# EAGLE design xmega_revC (EAGLE 6.1)
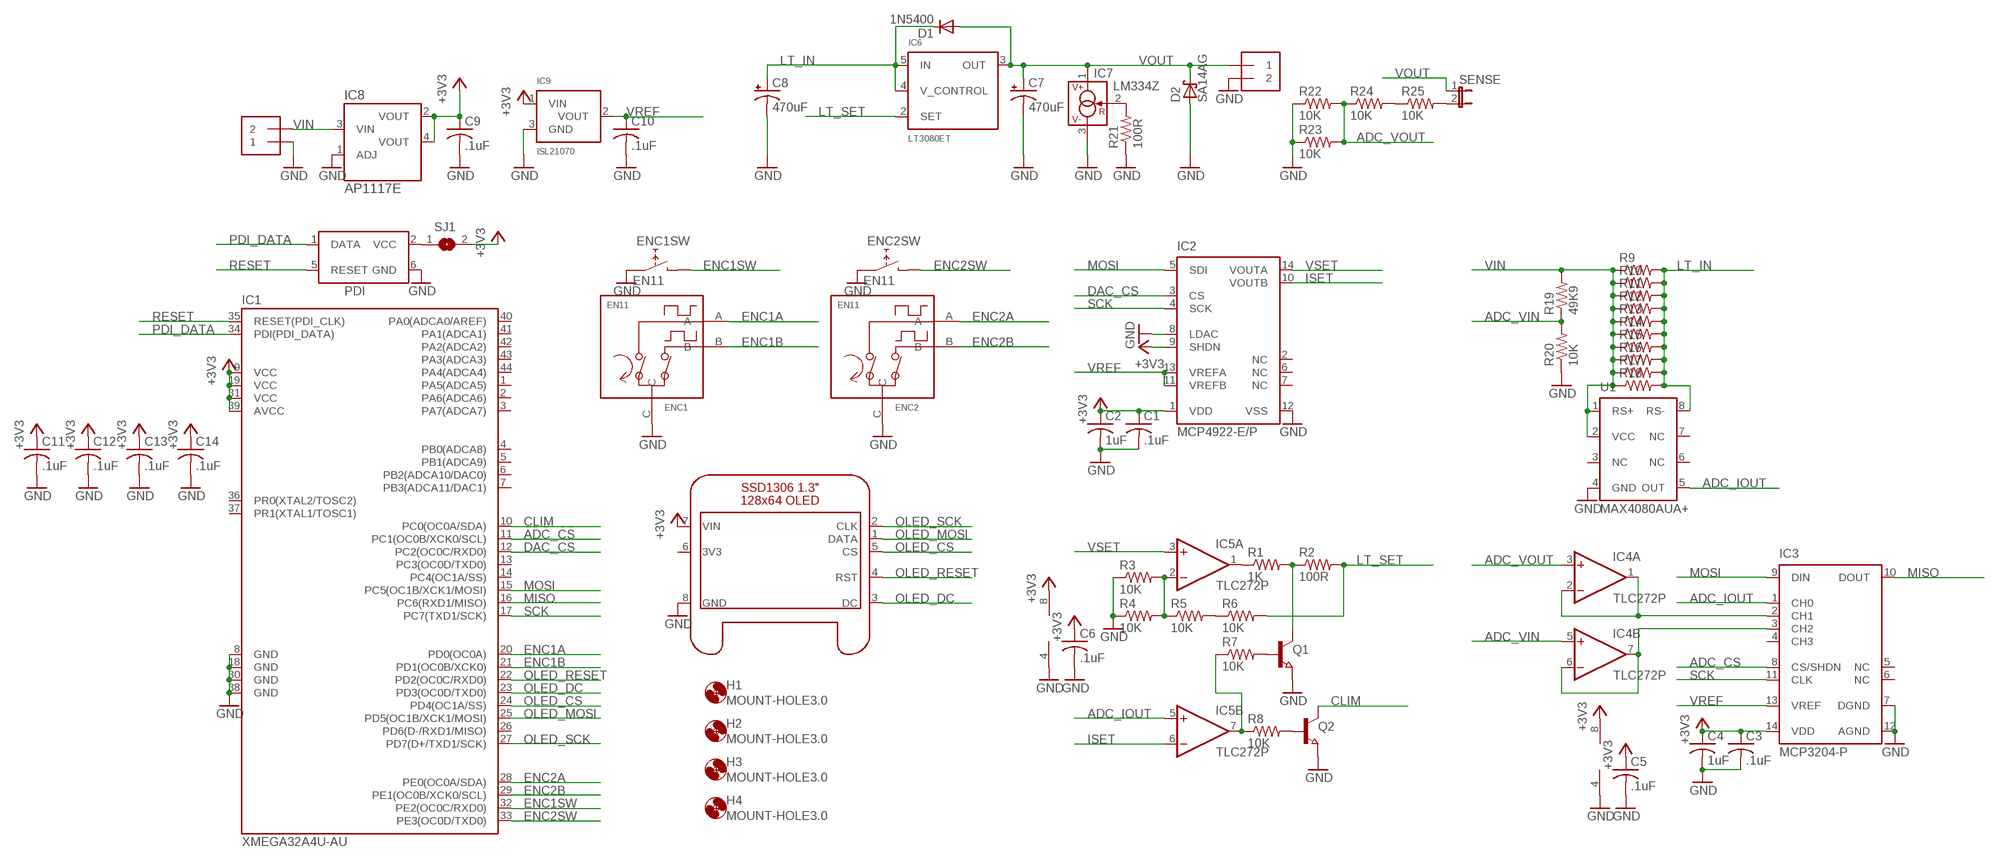
[diagram p0: schematic, sheet 1]

## Parts
C1  .1uF  C-US050-024X044  [C050-024X044]
C2  1uF  C-US050-024X044  [C050-024X044]
C3  .1uF  C-US050-024X044  [C050-024X044]
C4  1uF  C-US050-024X044  [C050-024X044]
C5  .1uF  C-US050-024X044  [C050-024X044]
C6  .1uF  C-US050-024X044  [C050-024X044]
C7  470uF  CPOL-USE5-10.5  [E5-10,5]
C8  470uF  CPOL-USE5-10.5  [E5-10,5]
C9  .1uF  C-US050-024X044  [C050-024X044]
C10  .1uF  C-US050-024X044  [C050-024X044]
C11  .1uF  C-USC0805K  [C0805K]
C12  .1uF  C-USC0805K  [C0805K]
C13  .1uF  C-USC0805K  [C0805K]
C14  .1uF  C-USC0805K  [C0805K]
D1  1N5400  [DO201-15]
D2  SA14AG  SCHOTTKY-DIODEDO41-7  [DO41-7]
ENC1  EN11  [EN11-VS*]
ENC2  EN11  [EN11-VS*]
H1  MOUNT-HOLE3.0  [3,0]
H2  MOUNT-HOLE3.0  [3,0]
H3  MOUNT-HOLE3.0  [3,0]
H4  MOUNT-HOLE3.0  [3,0]
IC1  XMEGA32A4U-AU  [TQFP44]
IC2  MCP4922-E/P  [DIL14]
IC3  MCP3204-P  [DIL14]
IC4  TLC272P  [DIL08]
IC5  TLC272P  [DIL08]
IC6  LT3080ET  [TO220-51]
IC7  LM334Z  [TO92]
IC8  AP1117E  [SOT223-3]
IC9  ISL21070  [SOT-23]
OLED1  128X64_OLED  [128X64_OLED]
OUT  1X2-3.5MM  [1X2-3.5MM]
PDI  XMEGAPDI  [AVRISP]
Q1  NPN-TRANSISTOR_SOT23  [SOT23]
Q2  NPN-TRANSISTOR_SOT23  [SOT23]
R1  1K  R-US_R0805  [R0805]
R2  100R  R-US_R0805  [R0805]
R3  10K  R-US_R0805  [R0805]
R4  10K  R-US_R0805  [R0805]
R5  10K  R-US_R0805  [R0805]
R6  10K  R-US_R0805  [R0805]
R7  10K  R-US_R0805  [R0805]
R8  10K  R-US_R0805  [R0805]
R9  R-US_0207/10  [0207/10]
R10  R-US_0207/10  [0207/10]
R11  R-US_0207/10  [0207/10]
R12  R-US_0207/10  [0207/10]
R13  R-US_0207/10  [0207/10]
R14  R-US_0207/10  [0207/10]
R15  R-US_0207/10  [0207/10]
R16  R-US_0207/10  [0207/10]
R17  R-US_0207/10  [0207/10]
R18  R-US_0207/10  [0207/10]
R19  49K9  R-US_R0805  [R0805]
R20  10K  R-US_R0805  [R0805]
R21  100R  R-US_R0805  [R0805]
R22  10K  R-US_R0805  [R0805]
R23  10K  R-US_R0805  [R0805]
R24  10K  R-US_R0805  [R0805]
R25  10K  R-US_R0805  [R0805]
SENSE  JP1E  [JP1]
SJ1  SJ  [SJ]
U1  MAX4080AUA+  [SO08]
VIN  1X2-3.5MM  [1X2-3.5MM]

## Nets
+3V3: C1.1 C2.1 C3.1 C4.1 C5.1 C6.1 C9.1 C11.1 C12.1 C13.1 C14.1 IC1.9(VCC) IC1.19(VCC) IC1.31(VCC) IC1.39(AVCC) IC2.1(VDD) IC2.9(SHDN) IC3.14(VDD) IC4.8(P:V+) IC5.8(P:V+) IC8.2(VOUT) IC8.4(VOUT) IC9.1(VIN) OLED1.7(VIN) SJ1.2
ADC_CS: IC1.11(PC1(OC0B/XCK0/SCL)) IC3.8(CS/SHDN)
ADC_IOUT: IC3.1(CH0) IC5.5(B:+IN) U1.5(OUT)
ADC_VIN: IC4.5(B:+IN) R19.1 R20.2
ADC_VOUT: IC4.3(A:+IN) R22.2 R23.2 R24.1
CLIM: IC1.10(PC0(OC0A/SDA)) Q2.3(C)
DAC_CS: IC1.12(PC2(OC0C/RXD0)) IC2.3(CS)
ENC1A: ENC1.A IC1.20(PD0(OC0A))
ENC1B: ENC1.B IC1.21(PD1(OC0B/XCK0))
ENC1SW: ENC1.E IC1.32(PE2(OC0C/RXD0))
ENC2A: ENC2.A IC1.28(PE0(OC0A/SDA))
ENC2B: ENC2.B IC1.29(PE1(OC0B/XCK0/SCL))
ENC2SW: ENC2.E IC1.33(PE3(OC0D/TXD0))
GND: C1.2 C2.2 C3.2 C4.2 C5.2 C6.2 C7.- C8.- C9.2 C10.2 C11.2 C12.2 C13.2 C14.2 D2.A ENC1.C ENC1.D ENC2.C ENC2.D IC1.8(GND) IC1.18(GND) IC1.30(GND) IC1.38(GND) IC2.8(LDAC) IC2.12(VSS) IC3.7(DGND) IC3.12(AGND) IC4.4(P:V-) IC5.4(P:V-) IC7.3(V-) IC8.1(ADJ) IC9.3(GND) OLED1.8(GND) OUT.2 PDI.6(GND) Q1.2(E) Q2.2(E) R3.1 R4.1 R20.1 R21.1 R22.1 R23.1 U1.4(GND) VIN.1
ISET: IC2.10(VOUTB) IC5.6(B:-IN)
LT_IN: C8.+ D1.C IC6.4(V_CONTROL) IC6.5(IN) R9.2 R10.2 R11.2 R12.2 R13.2 R14.2 R15.2 R16.2 R17.2 R18.2 U1.8(RS-)
LT_SET: IC6.2(SET) R2.2 R6.2
MISO: IC1.16(PC6(RXD1/MISO)) IC3.10(DOUT)
MOSI: IC1.15(PC5(OC1B/XCK1/MOSI)) IC2.5(SDI) IC3.9(DIN)
N$1: IC3.2(CH1) IC4.1(A:OUT) IC4.2(A:-IN)
N$2: IC3.3(CH2) IC4.6(B:-IN) IC4.7(B:OUT)
N$3: IC5.1(A:OUT) R1.1
N$4: Q1.3(C) R1.2 R2.1
N$5: IC5.2(A:-IN) R3.2 R4.2 R5.1
N$6: R5.2 R6.1
N$7: Q1.1(B) R7.2
N$8: IC5.7(B:OUT) R7.1 R8.1
N$9: Q2.1(B) R8.2
N$10: R25.2 SENSE.2
N$11: PDI.2(VCC) SJ1.1
N$13: IC7.2(R) R21.2
N$15: R24.2 R25.1
OLED_CS: IC1.24(PD4(OC1A/SS)) OLED1.5(CS)
OLED_DC: IC1.23(PD3(OC0D/TXD0)) OLED1.3(DC)
OLED_MOSI: IC1.25(PD5(OC1B/XCK1/MOSI)) OLED1.1(DATA)
OLED_RESET: IC1.22(PD2(OC0C/RXD0)) OLED1.4(RST)
OLED_SCK: IC1.27(PD7(D+/TXD1/SCK)) OLED1.2(CLK)
PDI_DATA: IC1.34(PDI(PDI_DATA)) PDI.1(DATA)
RESET: IC1.35(RESET(PDI_CLK)) PDI.5(RESET)
SCK: IC1.17(PC7(TXD1/SCK)) IC2.4(SCK) IC3.11(CLK)
VIN: IC8.3(VIN) R9.1 R10.1 R11.1 R12.1 R13.1 R14.1 R15.1 R16.1 R17.1 R18.1 R19.2 U1.1(RS+) U1.2(VCC) VIN.2
VOUT: C7.+ D1.A D2.C IC6.3(OUT) IC7.1(V+) OUT.1 SENSE.1
VREF: C10.1 IC2.11(VREFB) IC2.13(VREFA) IC3.13(VREF) IC9.2(VOUT)
VSET: IC2.14(VOUTA) IC5.3(A:+IN)
Unconnected: IC1.1(PA5(ADCA5)) IC1.2(PA6(ADCA6)) IC1.3(PA7(ADCA7)) IC1.4(PB0(ADCA8)) IC1.5(PB1(ADCA9)) IC1.6(PB2(ADCA10/DAC0)) IC1.7(PB3(ADCA11/DAC1)) IC1.13(PC3(OC0D/TXD0)) IC1.14(PC4(OC1A/SS)) IC1.26(PD6(D-/RXD1/MISO)) IC1.36(PR0(XTAL2/TOSC2)) IC1.37(PR1(XTAL1/TOSC1)) IC1.40(PA0(ADCA0/AREF)) IC1.41(PA1(ADCA1)) IC1.42(PA2(ADCA2)) IC1.43(PA3(ADCA3)) IC1.44(PA4(ADCA4)) IC2.2(NC) IC2.6(NC) IC2.7(NC) IC3.4(CH3) IC3.5(NC) IC3.6(NC) U1.3(NC) U1.6(NC) U1.7(NC)

## Power pins joined to a net without a drawn wire
3V3: OLED1.6(3V3)

## Library data of the parts
C1-C6 C9-C14 = adafruit:C-US: CAPACITOR, American symbol
C7 C8 = adafruit:CPOL-US: POLARIZED CAPACITOR, American symbol
D1 = diode:1N5400: DIODE standard rectifier, 3 A, 50 V (Motorola)
D2 = adafruit:SCHOTTKY-DIODE: Schottky Diode
ENC1 ENC2 = rotary-encoder:EN11
H1-H4 = holes:MOUNT-HOLE: MOUNTING HOLE with drill center marker
IC1 = atmel:XMEGA32A4U: 8/16-bit Atmel XMEGA A4U Microcontroller Features High-performance, Low-power 8/16-bit AVR XMEGA Microcontroller Non-Volatile Program and Data Memories - 16 KB - 128 KB of In-System Self-Programmable Flash - 4 KB - 8 KB Boot Code Section with Independent Lock Bits - 1 KB - 2 KB EEPROM - 2 KB - 8 KB Internal SRAM Peripheral Features - Four-channel DMA Controller with support for external requests - Eight-channel Event System - Five 16-bit Timer/Counters Three Timer/Counters with 4 Output Compare or Input Capture channels Two Timer/Counters with 2 Output Compare or Input Capture channels High-Resolution Extensions on all Timer/Counters Advanced Waveform Extension on one Timer/Counter - One USB device interface USB 2.0 full speed (12Mbps) and low speed (1.5Mbps) device compliant 32 Endpoints with full configuration flexibility - Five USARTs IrDA Extension on one USART - Two Two-Wire Interfaces with dual address match (I2C and SMBus compatible) - Two SPIs (Serial Peripheral Interfaces) peripherals - AES and DES Crypto Engine - 16-bit Real Time Counter with Separate Oscillator - One Twelve-channel, 12-bit, 2 Msps Analog to Digital Converter - One Two-channel, 12-bit, 1 Msps Digital to Analog Converter - Two Analog Comparators with Window compare function - External Interrupts on all General Purpose I/O pins - Programmable Watchdog Timer with Separate On-chip Ultra Low Power Oscillator Special Microcontroller Features - Power-on Reset and Programmable Brown-out Detection - Internal and External Clock Options with PLL - Programmable Multi-level Interrupt Controller - Sleep Modes: Idle, Power-down, Standby, Power-save, Extended Standby - Advanced Programming, Test and Debugging Interfaces PDI (Program and Debug Interface) for programming, test and debugging I/O and Packages - 34 Programmable I/O Lines - 44 - lead TQFP - 44 - pad VQFN/QFN - 49 - ball VFBGA Operating Voltage - 1.6 - 3.6V Speed performance - 0 - 12 MHz @ 1.6 - 3.6V - 0 - 32 MHz @ 2.7 - 3.6V
IC2 = microchip:MCP4922: MCP49X2 8/10/12-Bit Dual Voltage Output Digital-to-Analog Converter with SPI Interface Source: MCP4902/4912/4922 Datasheet <http://ww1.microchip.com/downloads/en/DeviceDoc/22250A.pdf/>
IC3 = microchip:MCP3204: MCP3204 2.7V 4-Channel 12-Bit A/D Converters with SPI Serial Interface Source: MCP3204/08 Datasheet <http://ww1.microchip.com/downloads/en/DeviceDoc/21298E.pdf>
IC4 IC5 = linear:TLC272: OP AMP
IC6 = linear:LT3080
IC7 = linear:LM*34: 3-Terminal Adjustable Current Sources Source: www.national.com/pf/LM/LM334.html | LM134.pdf
IC8 = Diodes Inc:AP1117: AP1117 1A Low Dropout Positive Adjustable or Fixed-Mode Regualtor Source: AP1117 Datasheet <http://www.diodes.com/datasheets/AP1117.pdf>
IC9 = intersil:ISL21070
OLED1 = oled displays:128X64_OLED: SSD1306 1.3" 128x64 OLED Display These displays are small, only about 1.3" diagonal, but very readable due to the high contrast of an OLED display. This display is made of 128x64 individual white OLED pixels, each one is turned on or off by the controller chip. Because the display makes its own light, no backlight is required. This reduces the power required to run the OLED and is why the display has such high contrast; we really like this miniature display for its crispness! The driver chip, SSD1306 can communicate in two ways: I2C or SPI. The OLED itself require a 3.3V power supply and 3.3V logic levels for communication, but we include a 3.3V regulator and all pins are fully level shifted so you can use with 5V devices! The power requirements depend a little on how much of the display is lit but on average the display uses about 40mA from the 3.3V supply. Built into the OLED driver is a simple switch-cap charge pump that turns 3.3v-5v into a high voltage drive for the OLEDs. Adafruit Product Page <http://www.adafruit.com/products/938>
OUT VIN = adafruit:1X2: 3.5mm Terminal block http://www.ladyada.net/library/pcb/eaglelibrary.html
PDI = icsp:XMEGAPDI: ATXmega PDI Header Program and Debug Interface
Q1 Q2 = semicon-smd-ipc:NPN-TRANSISTOR_: NPN TRANSISTOR
R1-R25 = adafruit:R-US_: RESISTOR, American symbol
SENSE = jumper:JP1E: JUMPER
SJ1 = jumper:SJ: SMD solder JUMPER
U1 = maxim:MAX4080: MAX4080/MAX4081 High-Side, Current-Sense Amplifiers with Voltage Output Source: MAX4080/MAX4081 Datasheet <http://datasheets.maxim-ic.com/en/ds/MAX4080-MAX4081.pdf>

## Board
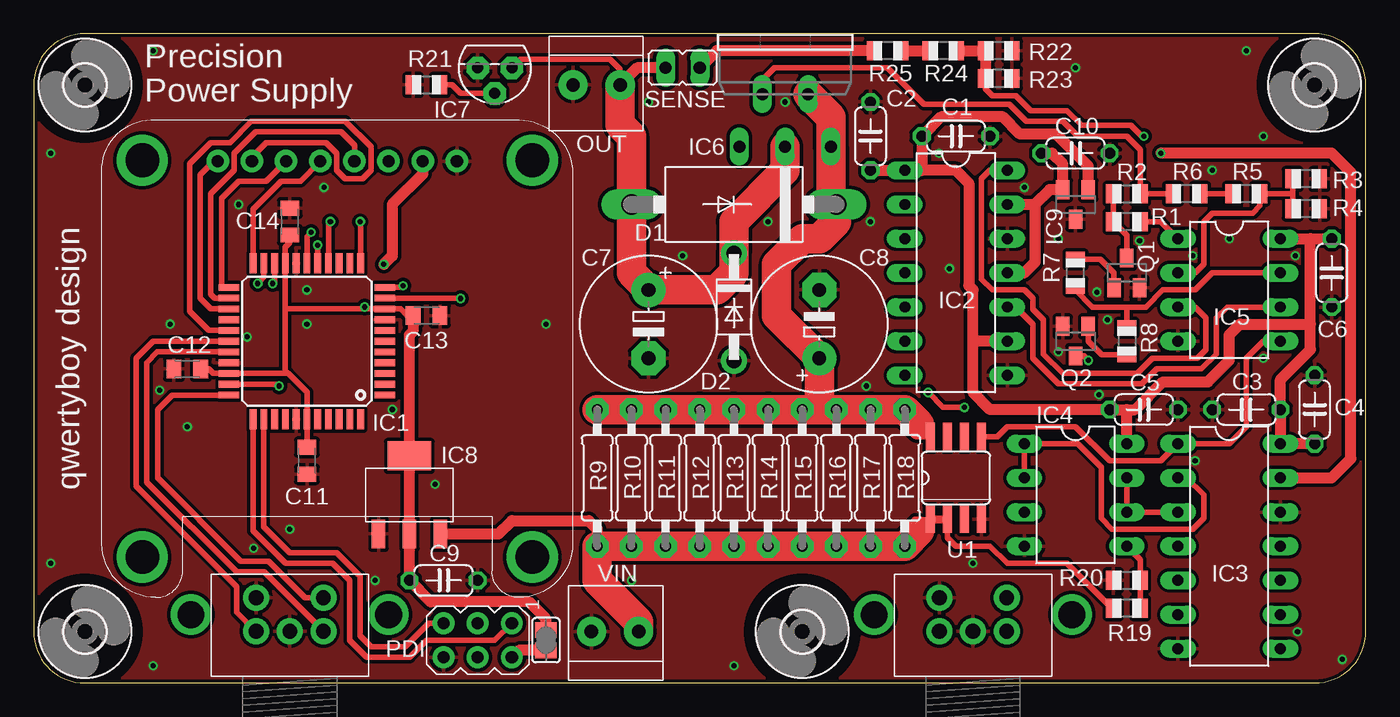
[diagram p1: board, top side]
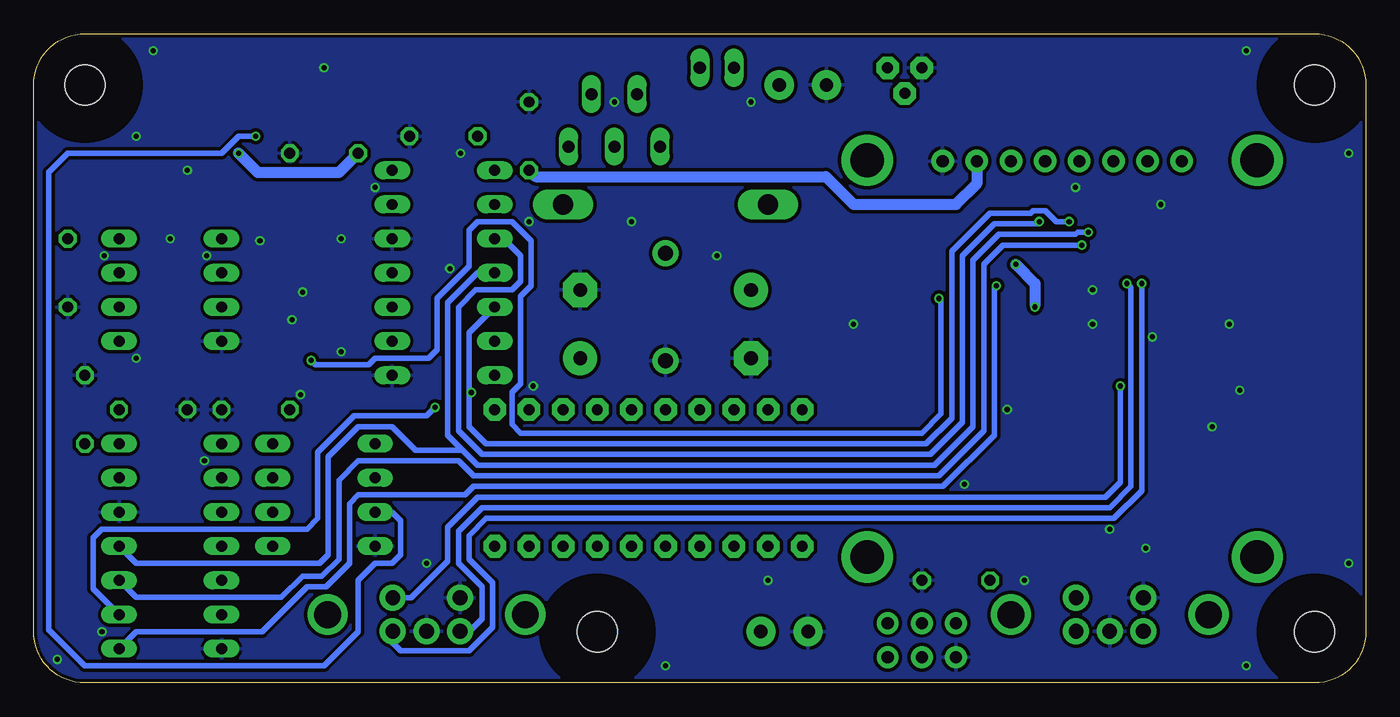
[diagram p2: board, bottom side, seen from below]

Size 99.06 x 48.26 mm. Coordinates in mm from the lower left corner, seen from the top.
Outline: 3.81,0 95.25,0 arc90 99.06,3.81 99.06,44.45 arc90 95.25,48.26 3.81,48.26 arc90 0,44.45 0,3.81 arc90 3.81,0
Copper layers (1*16): Top 0.035mm / dielectric 1.5mm / Bottom 0.035mm
Design rules: minimum track width 6mil, minimum drill 12mil, track to track 6mil, track to pad 6mil, pad to pad 6mil, via to via 6mil, smd to smd 0mil, copper to edge 10mil, drill to drill 10mil, minimum pad ring 10mil, minimum via ring 6mil, stop-mask expansion 2mil, vias tented up to drill 100mil, thermal gap 10mil

### Footprints (pad centres in the part's own frame; a part is rotated, then mirrored left to right if it is on the bottom)
C050-024X044 = drill 0.813 octagon: 1 -2.54,0; 2 2.54,0
E5-10,5 = drill 1.016 pad 2.54: + -2.54,0 | drill 1.016 pad 2.54 octagon: - 2.54,0
C0805K = smd 1.1 x 1.4: 1 -1,0; 2 1,0
DO201-15 = drill 1.499 long: A 7.62,0; C -7.62,0
DO41-7 = drill 1.118 pad 1.93: A 4,0; C -4,0
EN11-VS* = drill 1.1 pad 1.93: A -2.5,-1.25; B 2.5,-1.25; C 0,-1.25; D -2.5,1.25; E 2.5,1.25 | drill 2: P$1 7.35,0; P$2 -7.35,0
3,0 = hole 3: 0,0
TQFP44 = smd 1.5 x 0.5: 1 -5.8,4; 2 -5.8,3.2; 3 -5.8,2.4; 4 -5.8,1.6; 5 -5.8,0.8; 6 -5.8,0; 7 -5.8,-0.8; 8 -5.8,-1.6; 9 -5.8,-2.4; 10 -5.8,-3.2; 11 -5.8,-4; 23 5.8,-4; 24 5.8,-3.2; 25 5.8,-2.4; 26 5.8,-1.6; 27 5.8,-0.8; 28 5.8,0; 29 5.8,0.8; 30 5.8,1.6; 31 5.8,2.4; 32 5.8,3.2; 33 5.8,4 | smd 0.5 x 1.5: 12 -4,-5.8; 13 -3.2,-5.8; 14 -2.4,-5.8; 15 -1.6,-5.8; 16 -0.8,-5.8; 17 0,-5.8; 18 0.8,-5.8; 19 1.6,-5.8; 20 2.4,-5.8; 21 3.2,-5.8; 22 4,-5.8; 34 4,5.8; 35 3.2,5.8; 36 2.4,5.8; 37 1.6,5.8; 38 0.8,5.8; 39 0,5.8; 40 -0.8,5.8; 41 -1.6,5.8; 42 -2.4,5.8; 43 -3.2,5.8; 44 -4,5.8
DIL14 = drill 0.813 long: 1 -7.62,-3.81; 2 -5.08,-3.81; 3 -2.54,-3.81; 4 0,-3.81; 5 2.54,-3.81; 6 5.08,-3.81; 7 7.62,-3.81; 8 7.62,3.81; 9 5.08,3.81; 10 2.54,3.81; 11 0,3.81; 12 -2.54,3.81; 13 -5.08,3.81; 14 -7.62,3.81
DIL08 = drill 0.813 pad 1.27 long: 1 -3.81,-3.81; 2 -1.27,-3.81; 3 1.27,-3.81; 4 3.81,-3.81; 5 3.81,3.81; 6 1.27,3.81; 7 -1.27,3.81; 8 -3.81,3.81
TO220-51 = drill 0.9 long: 1 -3.4,-8.4; 2 -1.7,-4.5; 3 0,-8.4; 4 1.7,-4.5; 5 3.4,-8.4
TO92 = drill 0.813 pad 1.676 octagon: 1 -1.27,0; 2 0,1.905; 3 1.27,0
SOT223-3 = smd 1 x 2.15: 1 -2.3,-2.9; 2 0,-2.9; 3 2.3,-2.9 | smd 3.25 x 2.15: 4 0,2.9
SOT-23 = smd 1 x 1.4: 1 -0.95,-1.1; 2 0.95,-1.1; 3 0,1.1
128X64_OLED = drill 0.9 pad 1.676: 1 8.61,32.43; 2 11.15,32.43; 3 13.69,32.43; 4 16.23,32.43; 5 18.77,32.43; 6 21.31,32.43; 7 23.85,32.43; 8 26.39,32.43 | drill 2.5 pad 3.81: P$1 3,3; P$2 3,32.5; P$3 32,32.5; P$4 32,3
1X2-3.5MM = drill 1 pad 2.184: 1 -1.7,0; 2 1.8,0
AVRISP = drill 0.9 pad 1.626: 1 -1.27,2.54; 2 1.27,2.54; 3 -1.27,0; 4 1.27,0; 5 -1.27,-2.54; 6 1.27,-2.54
SOT23 = smd 1 x 1.4: 1 -0.95,-1.1; 2 0.95,-1.1; 3 0,1.1
R0805 = smd 1.1 x 1.4: 1 -1,0; 2 1,0
0207/10 = drill 0.813 pad 1.676 octagon: 1 -5.08,0; 2 5.08,0
JP1 = drill 0.914 long: 1 0,-1.27; 2 0,1.27
SJ = smd 1.168 x 1.6: 1 -0.762,0; 2 0.762,0
SO08 = smd 0.66 x 2.032: 1 -1.905,-3.073; 2 -0.635,-3.073; 3 0.635,-3.073; 4 1.905,-3.073; 5 1.905,3.073; 6 0.635,3.073; 7 -0.635,3.073; 8 -1.905,3.073

### Placement (x,y rotation side)
C1  68.58,40.64 0 top
C2  62.23,40.64 90 top
C3  90.17,20.32 180 top
C4  95.25,20.32 90 top
C5  82.55,20.32 0 top
C6  96.52,30.48 270 top
C7  45.72,26.67 270 top
C8  58.42,26.67 90 top
C9  30.48,7.62 0 top
C10  77.47,39.37 0 top
C11  20.32,16.51 270 top
C12  11.43,23.34 180 top
C13  29.21,27.3 0 top
C14  19.05,34.29 90 top
D1  52.07,35.56 180 top
D2  52.07,27.94 270 top
ENC1  69.85,5.08 0 top
ENC2  19.05,5.08 0 top
H1  3.81,3.81 0 top
H2  3.81,44.45 0 top
H3  57.15,3.81 0 top
H4  95.25,44.45 0 top
IC1  20.32,25.4 180 top
IC2  68.58,30.48 270 top
IC3  88.9,10.16 270 top
IC4  77.47,13.97 270 top
IC5  88.9,29.21 270 top
IC6  55.88,48.26 0 top
IC7  34.29,45.72 180 top
IC8  27.94,13.97 0 top
IC9  77.47,35.56 180 top
OLED1  5.08,6.35 0 top
OUT  41.91,44.45 180 top
PDI  33.02,3.17 270 top
Q1  81.28,30.48 0 top
Q2  77.47,25.4 180 top
R1  81.28,34.29 180 top
R2  81.28,36.35 0 top
R3  94.61,37.47 180 top
R4  94.61,35.24 180 top
R5  90.17,36.35 180 top
R6  85.72,36.35 180 top
R7  77.47,30.48 90 top
R8  81.28,25.4 270 top
R9  41.91,15.24 90 top
R10  44.45,15.24 90 top
R11  46.99,15.24 90 top
R12  49.53,15.24 90 top
R13  52.07,15.24 90 top
R14  54.61,15.24 90 top
R15  57.15,15.24 90 top
R16  59.69,15.24 90 top
R17  62.23,15.24 90 top
R18  64.77,15.24 90 top
R19  81.28,5.56 180 top
R20  81.28,7.62 0 top
R21  29.21,44.45 0 top
R22  71.75,46.99 180 top
R23  71.75,44.93 180 top
R24  67.63,46.99 180 top
R25  63.5,46.99 180 top
SENSE  48.26,45.72 270 top
SJ1  38.1,3.17 90 top
U1  68.58,15.24 0 top
VIN  43.18,3.81 0 top

### Tracks (layer width: path | path; a pad name or v marks a point on that pad's centre or on a via)
+3V3  (via drill 0.38)
  Top 0.406: IC1.9 27.29,27.8 27.78,27.3 C13.1 | C11.1 IC1.39 20.32,21.59 18.91,23 | IC1.19 18.72,32.37 19.05,32.7 C14.1 | C12.1 13.02,23.34 13.35,23 IC1.31 18.91,23 | IC1.19 18.72,23.19 18.91,23 | IC1.9 18.75,27.8 18.73,27.78 18.72,27.79 IC1.19 | IC1.9 24.75,27.8 v24.61,27.94
  Top 0.813: C2.1 IC2.1 66.04,38.1 | C4.1 IC3.14 C3.1 92.71,22.54 94.93,24.77 94.93,26.67 | IC5.8 94.93,33.02 | 94.93,33.02 C6.1 | IC9.1 78.42,38.42 76.04,40.8 73.34,40.8 72.07,42.07 67.47,42.07 C1.1 66.04,38.1 | 66.04,38.1 68.58,38.1 69.53,37.15 69.53,29.53 69.85,29.21 69.85,25.4 | 94.93,26.67 94.93,33.02 | SJ1.2 38.1,4.76 36.83,6.03 29.53,6.03 C9.1 IC8.2 IC8.4 27.94,25.88 28.21,26.15 C13.1 | 81.28,20.32 C5.1 71.12,20.32 69.85,21.59 69.85,25.4 | 81.28,20.32 81.92,20.32 83.98,22.38 87.31,22.38 88.9,23.97 88.9,25.88 89.69,26.67 94.93,26.67 | IC4.8 81.28,20.32 | IC2.9 69.85,25.4 | v26.04,31.11 26.67,31.75 26.67,35.56 28.93,37.82 OLED1.7
  Bottom 0.406: v24.61,27.94 24.61,28.1
  Bottom 0.813: C2.1 61.75,37.62 40.16,37.62 38.1,35.56 30.48,35.56 28.89,37.15 28.89,38.73 28.93,38.73 OLED1.7 | v26.04,31.11 24.61,29.69 24.61,28.1
ADC_CS  (via drill 0.38)
  Top 0.406: IC1.11 27.34,29.4 v27.46,29.53
  Bottom 0.406: IC3.8 91.44,3.81 82.07,3.81 78.74,7.14 77.31,7.14 75.56,8.89 75.56,13.34 74.93,13.97 66.99,13.97 66.36,14.61 31.43,14.61 27.62,18.41 27.62,29.37 v27.46,29.53
ADC_IOUT
  Top 0.406: IC5.5 91.44,25.4 90.17,24.13 90.17,19.05 88.9,17.78 IC3.1 83.82,16.51 80.01,16.51 77.47,19.05 72.39,19.05 71.65,18.31 U1.5
ADC_VIN
  Top 0.406: IC4.5 82.28,9.16 R20.2 R19.1
ADC_VOUT  (via drill 0.38)
  Top 0.406: R23.2 70.75,44.18 71.28,43.66 73.03,43.66 74.14,42.55 76.83,42.55 77.95,41.43 81.6,41.43 82.39,40.64 v82.55,40.64
  Top 0.813: R24.1 R22.2 R23.2
  Bottom 0.406: v82.55,40.64 83.82,40.64 85.09,39.37 96.52,39.37 97.95,37.94 97.95,3.97 95.25,1.27 77.47,1.27 74.93,3.81 74.93,7.62 73.66,8.89 72.39,8.89 71.75,9.53 71.75,12.06 72.39,12.7 IC4.3
CLIM  (via drill 0.38)
  Top 0.406: Q2.3 78.09,24.3 v78.42,23.97 | IC1.10 31.73,28.6 v31.75,28.57
  Bottom 0.406: v78.42,23.97 78.11,23.65 74.14,23.65 73.66,24.13 69.69,24.13 69.06,24.77 69.06,28.57 66.67,30.96 66.67,33.66 66.04,34.29 63.5,34.29 62.07,32.86 62.07,29.53 62.87,28.73 62.87,22.23 63.5,21.59 63.5,19.21 62.87,18.57 33.02,18.57 31.59,20 31.59,28.42 v31.75,28.57
DAC_CS  (via drill 0.38)
  Top 0.406: IC1.12 24.32,34.26 v24.29,34.29
  Bottom 0.406: IC2.3 64.14,33.02 62.87,31.75 62.87,29.84 63.5,29.21 66.2,29.21 67.47,27.94 67.47,18.73 65.72,16.99 32.38,16.99 30,19.37 30,31.75 27.62,34.13 24.45,34.13 v24.29,34.29
ENC1A  (via drill 0.38)
  Top 0.406: IC1.20 17.92,29.83 v17.78,29.69
  Bottom 0.406: ENC1.A 66.66,3.83 65.72,4.76 65.72,7.14 67.47,8.89 67.47,11.27 65.72,13.02 19.05,13.02 17.46,14.61 17.46,29.37 v17.78,29.69
ENC1B  (via drill 0.38)
  Top 0.406: IC1.21 17.12,30.14 v16.67,29.69
  Bottom 0.406: ENC1.B 72.35,2.98 71.75,2.38 66.67,2.38 64.93,4.13 64.93,7.46 66.67,9.21 66.67,10.95 65.41,12.22 18.73,12.22 16.67,14.29 v16.67,29.69
ENC1SW  (via drill 0.38)
  Top 0.406: IC1.32 18.12,22.2 v18.26,22.07
  Bottom 0.406: ENC1.E 70.98,6.33 68.26,9.05 68.26,11.59 66.04,13.81 19.37,13.81 18.26,14.92 v18.26,22.07
ENC2A
  Top 0.406: IC1.28 8.89,25.4 7.62,24.13 7.62,14.61 15.08,7.14 15.08,5.24 16.51,3.81 16.53,3.83 ENC2.A
ENC2B
  Top 0.406: IC1.29 9.2,24.6 8.41,23.81 8.41,14.92 15.08,8.26 17.14,8.26 21.55,3.85 ENC2.B
ENC2SW
  Top 0.406: ENC2.E 20.18,6.33 17.46,9.05 15.4,9.05 9.21,15.24 9.21,20.32 10.29,21.4 IC1.33
GND  (via drill 0.38)
  other vias: 82.23,32.86 86.2,31.75 79.85,26.99 79.06,29.05 76.2,24.61 9.37,21.75 16.35,10 11.43,19.05 15.24,35.56 15.88,25.72 20.32,29.21 21.59,36.83 73.66,36.83 67.31,39.37 91.44,40.64 90.17,46.99 77.47,45.72 87.63,38.1 88.9,33.02 93.82,31.75 91.44,24.13 86.36,16.51 93.98,3.81 97.31,1.75 79.22,21.43 76.2,33.02 68.1,30.8 62.23,34.29 61.91,22.07 54.61,34.29 55.88,43.18 45.72,43.18 48.26,31.75 8.89,46.99 1.27,39.37 1.27,8.89 8.89,1.27 10.16,26.67 26.67,20.32 25.4,7.62 19.05,11.43 29.84,14.76 52.07,1.27 69.85,8.89 38.1,26.67 20.32,26.67 44.45,7.62
  pour Top (isolate 0.254): 0,0 99.06,0 99.06,48.26 0,48.26
  pour Bottom (isolate 0.254): 0,0 99.06,0 99.06,48.26 0,48.26
ISET
  Top 0.406: IC2.10 73.03,27.94 74.3,26.67 74.3,24.13 76.2,22.23 82.39,22.23 83.5,23.34 86.84,23.34 87.95,24.45 87.95,27.15 88.74,27.94 IC5.6
LT_IN
  Top 0.61: U1.8 66.67,18.41 | 66.67,18.41 65.88,19.21 | 66.67,18.41 65.56,18.41 64.29,19.68
  Top 2.184: R9.2 R10.2 R11.2 R12.2 R13.2 R14.2 R15.2 58.42,20.32 | 58.42,20.32 R16.2 R17.2 R18.2 65.88,19.21 | 58.42,20.32 C8.+ 55.24,27.3 55.24,31.11 57.15,33.02 58.42,33.02 59.69,34.29 D1.C 59.28,35.97 IC6.5 59.28,42.06 IC6.4
LT_SET
  Top 0.406: R6.2 R2.2 82.28,39.64 81.28,40.64 77.63,40.64 76.52,41.75 73.82,41.75 72.55,43.02 66.2,43.02 63.5,45.72 55.09,45.72 54.18,44.81 IC6.2
MISO  (via drill 0.38)
  Top 0.406: IC1.16 v21.12,32.54 v21.11,32.54
  Bottom 0.406: IC3.10 91.44,6.35 80.64,6.35 79.06,7.94 77.63,7.94 76.36,9.21 76.36,15.08 74.93,16.51 67.47,16.51 66.36,15.4 31.75,15.4 28.42,18.73 28.42,31.11 26.99,32.54 v21.11,32.54
MOSI  (via drill 0.38)
  Top 0.406: v69.22,20.48 67.63,20.48 v66.52,21.59 | IC1.15 21.92,34.14 v22.07,34.29
  Bottom 0.406: IC2.5 66.67,26.04 66.67,21.59 | 66.67,21.59 66.67,19.05 65.41,17.78 32.7,17.78 30.8,19.68 30.8,32.07 27.94,34.92 24.92,34.92 24.77,35.08 23.81,35.08 23.02,34.29 v22.07,34.29 | IC3.9 94.61,6.99 94.61,10.79 93.98,11.43 78.74,11.43 77.95,12.22 77.95,17.14 75.25,19.84 69.85,19.84 v69.22,20.48 | v66.52,21.59 66.67,21.59
N$1
  Top 0.406: IC4.2 IC4.1 77.63,17.78 79.38,16.03 79.38,12.22 80.17,11.43 86.2,11.43 87,12.22 87,13.97 85.72,15.24 IC3.2
N$2
  Top 0.406: IC4.7 IC4.6 IC3.3
N$3
  Top 0.406: R1.1 83.82,34.29 IC5.1
N$4
  Top 0.406: R2.1 R1.2 81.28,33.29 Q1.3
N$5
  Top 0.406: IC5.2 86.36,30.48 87,31.11 87,34.29 87.63,34.92 90.65,34.92 91.17,35.45 R5.1 93.5,36.35 93.61,36.47 R3.2 R4.2
N$6
  Top 0.406: R6.1 R5.2
N$7
  Top 0.406: Q1.1 80.33,30.48 79.33,31.48 R7.2
N$8
  Top 0.406: R7.1 77.47,29.21 78.74,27.94 81.28,27.94 | IC5.7 87.63,30.48 86.36,29.21 83.98,29.21 82.71,27.94 81.28,27.94 | R8.1 81.28,27.94
N$9
  Top 0.406: Q2.1 78.42,25.4 79.42,24.4 R8.2
N$10
  Top 0.813: R25.2 50.8,46.99 SENSE.2
N$11
  Top 0.813: SJ1.1 36.07,2.41 PDI.2
N$13
  Top 0.406: R21.2 31.11,44.45 31.75,43.81 IC7.2
N$15
  Top 0.813: R25.1 R24.2
OLED_CS
  Top 0.406: IC1.24 13.47,28.6 13.18,28.89 13.18,36.35 14.92,38.1 14.92,39.37 16.51,40.96 22.86,40.96 23.85,39.97 OLED1.5
OLED_DC
  Top 0.406: IC1.23 14,29.4 13.97,29.37 13.97,36.04 15.24,37.31 17.3,37.31 OLED1.3
OLED_MOSI
  Top 0.406: OLED1.1 13.38,38.78 12.38,37.78 12.38,28.57 13.16,27.8 IC1.25
OLED_RESET
  Top 0.406: IC1.22 16.32,35.21 18.41,37.31 19.84,37.31 OLED1.4
OLED_SCK
  Top 0.406: IC1.27 13.01,26.2 11.59,27.62 11.59,38.58 13.18,40.16 14.61,40.16 16.19,41.75 23.18,41.75 25.08,39.85 25.08,38.1 24.45,37.47 23.18,37.47 22.54,38.1 22.54,39.37 21.75,40.16 17.3,40.16 16.23,39.09 OLED1.2
PDI_DATA
  Top 0.406: IC1.34 16.32,11.3 18.73,8.89 22.23,8.89 23.5,7.62 23.5,3.17 24.77,1.91 27.94,1.91 29.21,3.17 34.29,3.17 PDI.1
RESET
  Top 0.406: IC1.35 17.12,11.61 19.05,9.68 22.54,9.68 24.29,7.94 24.29,3.49 25.08,2.7 27.62,2.7 29.37,4.45 PDI.5
SCK  (via drill 0.38)
  Top 0.406: IC1.17 20.32,33.18 v20.64,33.5
  Bottom 0.406: 67.15,17.3 68.26,18.41 68.26,28.26 66.04,30.48 IC2.4 | 67.15,17.3 66.04,16.19 32.07,16.19 29.21,19.05 29.21,31.43 27.3,33.34 21.59,33.34 21.43,33.5 v20.64,33.5 | IC3.11 91.44,8.89 77.79,8.89 77.15,9.53 77.15,16.83 74.93,19.05 72.39,19.05 70.64,17.3 67.15,17.3
VIN
  Top 0.406: R19.2 80.17,5.56 76.83,8.89 72.39,8.89 71.12,10.16 68.58,10.16 67.94,10.79 U1.2
  Top 0.61: 66.67,12.06 U1.1 U1.2 | 66.67,12.06 65.88,11.27 | 66.67,12.06 65.56,12.06 64.29,10.79
  Top 0.813: IC8.3 34.56,11.07 35.56,12.06 41.27,12.06 41.91,11.43 R9.1
  Top 2.184: 65.88,11.27 R18.1 R17.1 R16.1 R15.1 R14.1 R13.1 R12.1 R11.1 R10.1 R9.1 41.91,7.62 44.98,4.55 VIN.2
VOUT
  Top 0.406: IC7.1 36.2,46.35 42.86,46.35 43.61,45.61 OUT.1
  Top 0.813: SENSE.1 44.88,45.72 OUT.1
  Top 2.184: OUT.1 43.61,41.48 44.45,40.64 D1.A 44.45,30.48 C7.+ 50.8,29.21 52.07,30.48 D2.C 52.07,34.29 55.88,38.1 IC6.3
VREF  (via drill 0.38)
  Top 0.813: IC2.11 73.66,30.48 74.45,31.27 74.45,35.56 | 74.45,35.56 75.55,36.66 IC9.2 76.52,38.57 75.72,39.37 C10.1 | IC2.13 74.45,35.56 | IC3.13 96.52,15.24 97.95,16.67 97.95,37.94 96.52,39.37 v83.82,39.37
  Bottom 0.813: v83.82,39.37 82.39,37.94 76.36,37.94 C10.1
VSET
  Top 0.406: IC5.3 86.36,27.94 87.15,27.15 87.15,24.77 86.52,24.13 83.19,24.13 82.07,23.02 76.52,23.02 75.09,24.45 75.09,26.99 74.3,27.78 74.3,28.57 73.66,29.21 71.28,29.21 70.48,30 70.48,37.47 71.12,38.1 IC2.14

### Text on the board
tPlace: Precision | Power Supply | qwertyboy design